# EasyEDA Pro project PCB_6N_2025-02-27.epro

# Board 6N_1
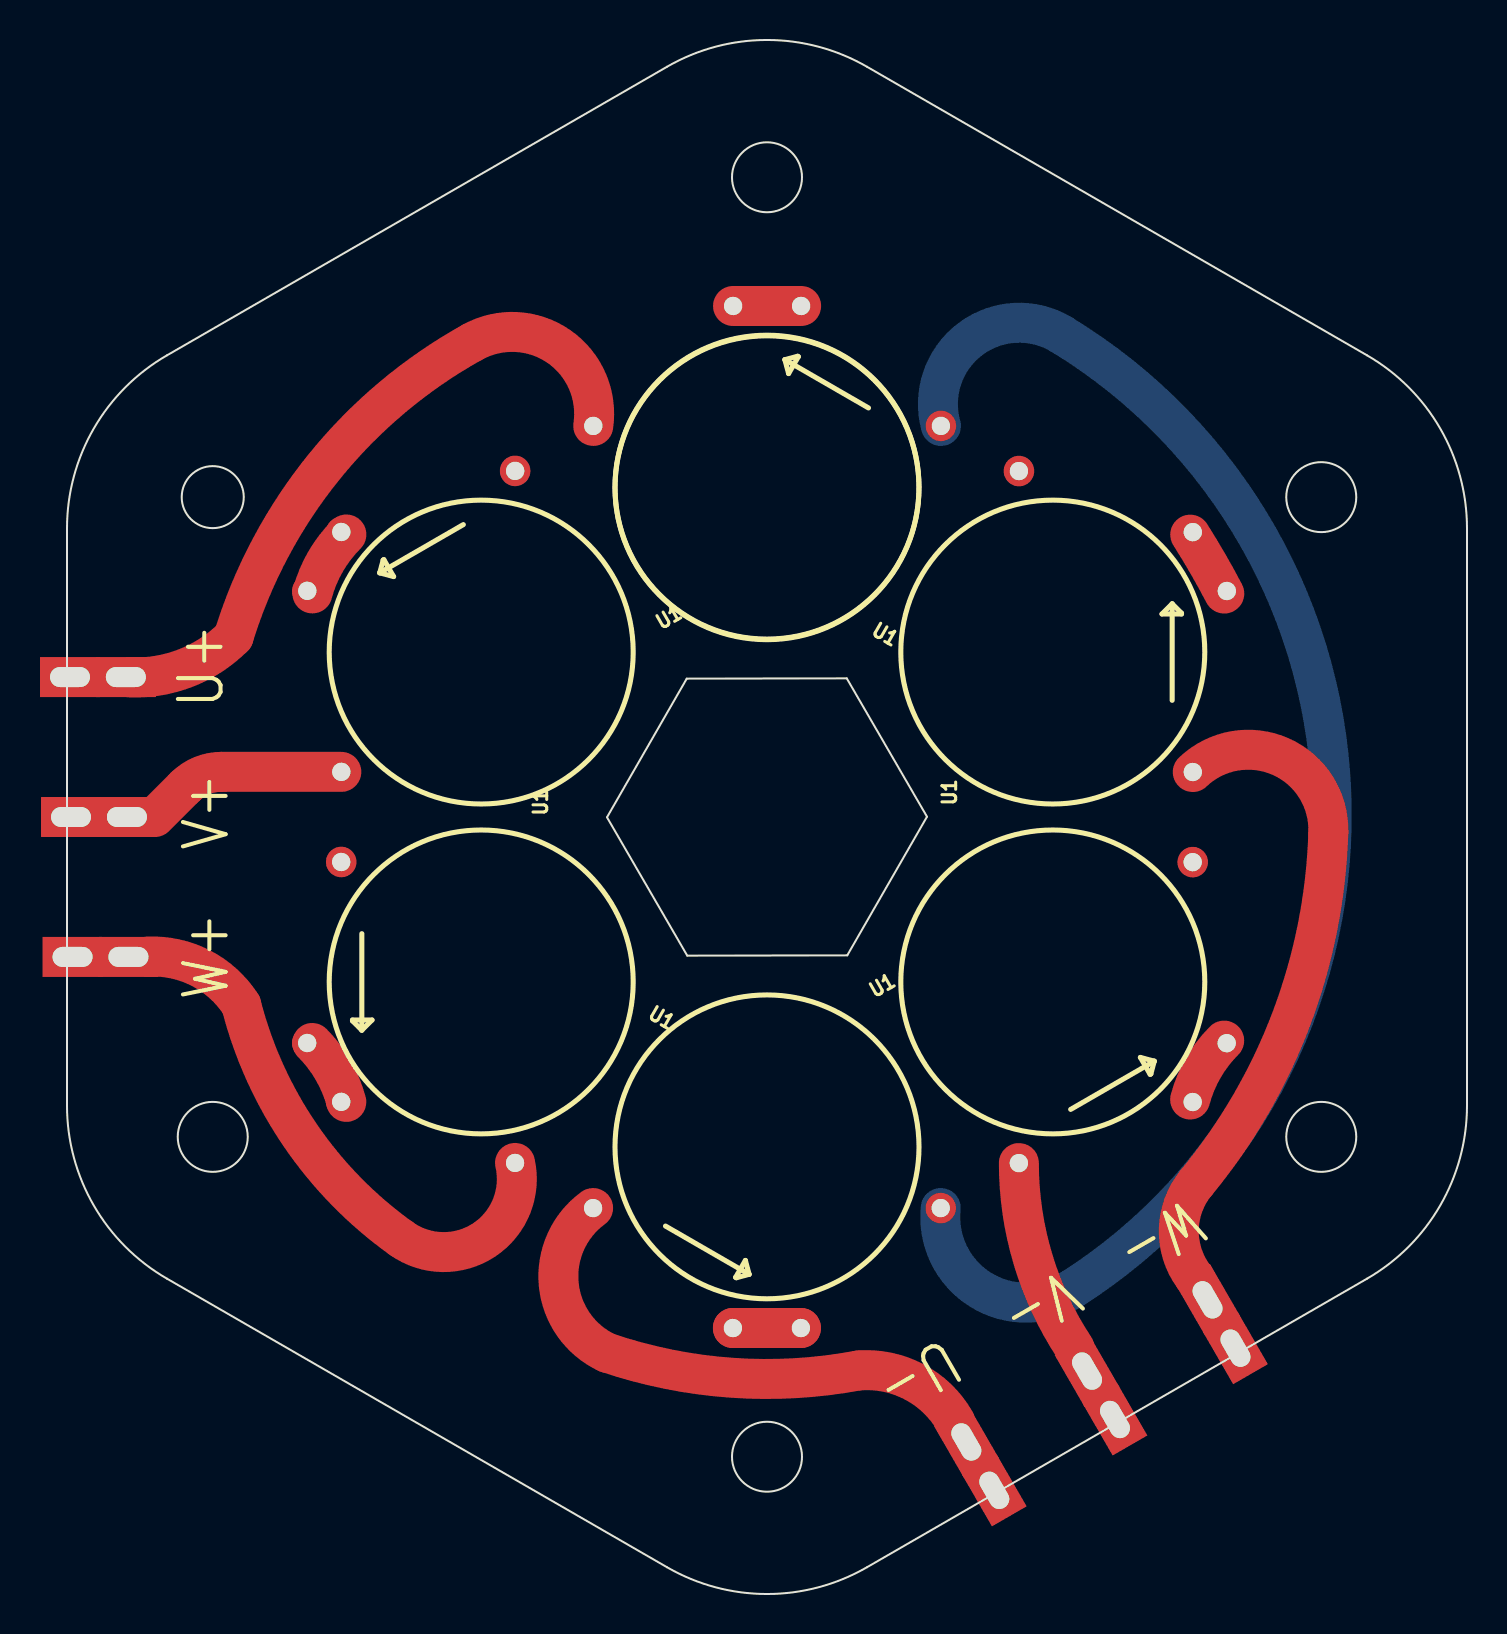
[diagram p0: board, top side]
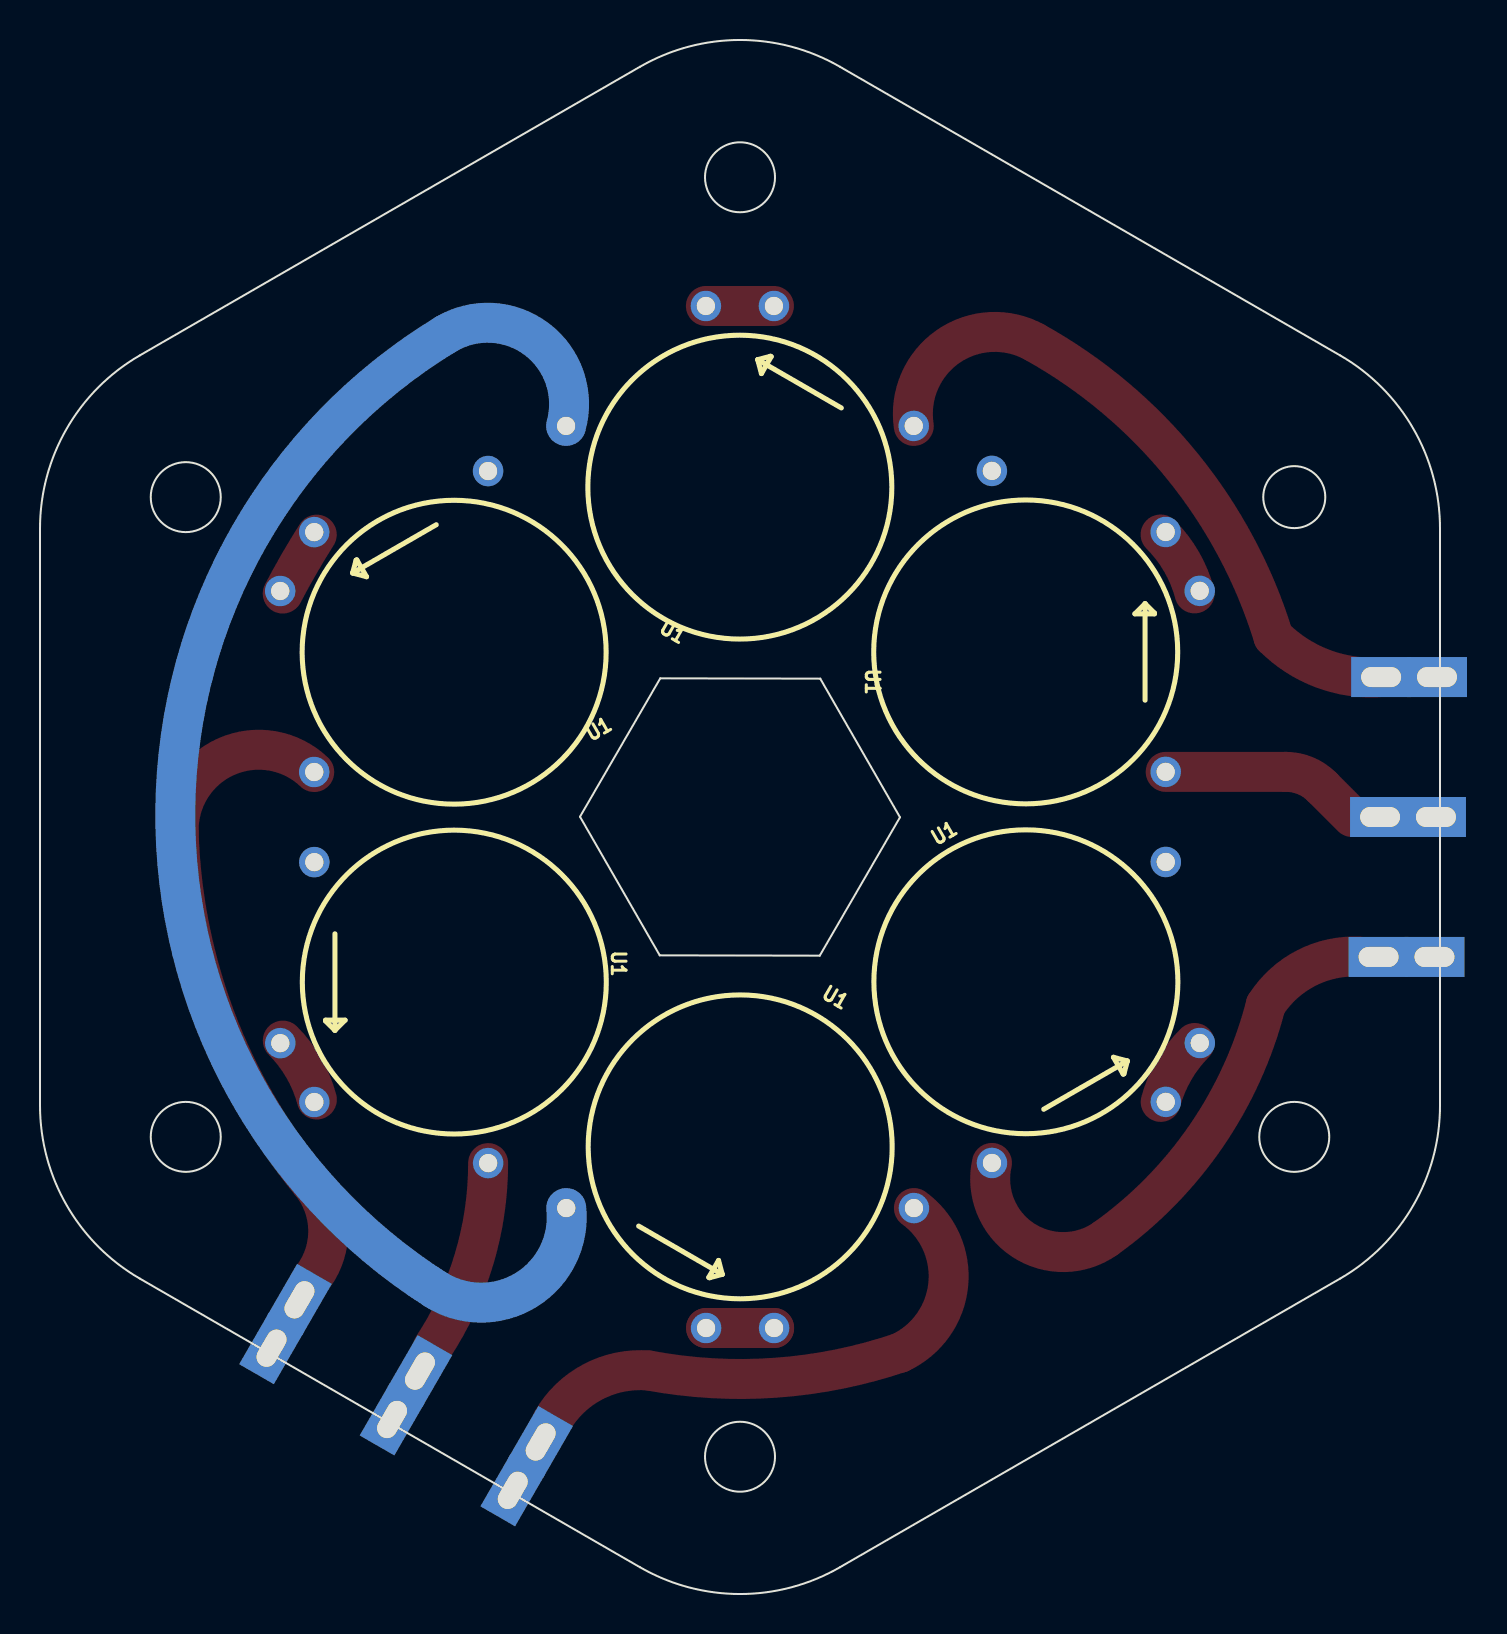
[diagram p1: board, bottom side, seen from below]

Outline 70 x 77.73 mm; copper layers: Top Layer, Inner1, Inner2, Bottom Layer. Coordinates in mm from the lower left corner of the outline.
Outline path: circle c7.29,54.87 r1.55 ; circle c7.29,22.87 r1.75 ; circle c35,70.87 r1.75 ; circle c35,6.87 r1.75 ; circle c62.71,54.87 r1.75 ; circle c62.71,22.87 r1.75 ; 0,53.3 0,24.43 arc(1.34,19.43) 5,15.77 30,1.34 arc(35,0) 40,1.34 65,15.77 arc(68.66,19.43) 70,24.43 70,53.3 arc(68.66,58.3) 65,61.96 40,76.39 arc(35,77.73) 30,76.39 5,61.96 arc(1.34,58.3) 0,53.3 ; 27,38.85 31.01,31.93 39.01,31.95 43,38.88 38.99,45.8 30.99,45.79 27,38.85
Stack: Top Layer 0.035mm 外层铜厚1oz / Dielectric1 0.2104mm 7628 RC49% 8.6mil / Inner1 0.0152mm 内层铜厚 / Dielectric2 1.065mm 1.1mm H/HOZ Copper / Inner2 0.0152mm 内层铜厚 / Dielectric3 0.2104mm 7628 RC49% 8.6mil / Bottom Layer 0.035mm 外层铜厚1oz

## Design rules (mm)
template: JLCPCB Capability(Two Layers Board)
spacing copperThickness1oz (default): track to track 0.102, other pairs 0.152 to 0.3
spacing copperThickness2oz: track to track 0.203, other pairs 0.152 to 0.3
track width copperThickness1oz (default): min 0.127, default 0.254, max 2.54
track width copperThickness2oz: min 0.203, default 0.254, max 2.54
differential pair differentialPair (default): width min 0.127, default 0.254, max 2.54; gap min 0.152, default 0.152
via viaSize (default): diameter min 0.5, default 0.61, max 10; hole min 0.3, default 0.305, max 6.3

## Placement (name value [footprint] x y rotation side)
NOREF  -  [Pad_e4749]  44.97 7.61 210 top
NOREF#2  -  [Pad_e4751]  52.4 8.73 210 top
NOREF#3  -  [Pad_e4746]  58.42 12.3 210 top
NOREF#4  -  [Pad_e4590]  51 11.15 210 top
NOREF#5  -  [Pad_e4747]  57.03 14.72 210 top
NOREF#6  -  [Pad_e4509]  3 38.87 90 top
NOREF#7  -  [Pad_e4748]  46.36 5.19 210 top
NOREF#8  -  [Pad_e4555]  0.2 38.87 90 top
NOREF#9  -  [Pad_e4687]  0.15 45.87 90 top
NOREF#10  -  [Pad_e4689]  0.28 31.87 90 top
NOREF#11  -  [Pad_e4690]  3.07 31.87 90 top
NOREF#12  -  [Pad_e4688]  2.94 45.87 90 top
U1  -  [CURRENT15]  35 55.37 150 top
U1#2  -  [CURRENT15]  20.71 47.12 210 top
U1#3  -  [CURRENT15]  20.71 30.62 270 top
U1#4  -  [CURRENT15]  35 22.37 330 top
U1#5  -  [CURRENT15]  49.29 30.62 30 top
U1#6  -  [CURRENT15]  49.29 47.12 90 top
U1#7  -  [CURRENT15]  20.72 47.12 90 bottom
U1#8  -  [CURRENT15]  20.71 30.62 150 bottom
U1#9  -  [CURRENT15]  34.99 22.37 210 bottom
U1#10  -  [CURRENT15]  49.28 30.61 270 bottom
U1#11  -  [CURRENT15]  49.29 47.11 330 bottom
U1#12  -  [CURRENT15]  35.01 55.37 30 bottom

## Footprints (pads in the part's own frame, mm; a bottom-side part is the same pattern mirrored in y, then rotated)
CURRENT15
  round 1.524 hole 0.914: 1(-6,-7) 2(6,-7)
Pad_e4509
  rect 2x3 hole 1x2: 10(0,0)
Pad_e4555
  rect 2x3 hole 1x2: 10(0,0)
Pad_e4590
  rect 2x3 hole 1x2: 14(0,0)
Pad_e4687
  rect 2x3 hole 1x2: 10(0,0)
Pad_e4688
  rect 2x3 hole 1x2: 10(0,0)
Pad_e4689
  rect 2x3 hole 1x2: 10(0,0)
Pad_e4690
  rect 2x3 hole 1x2: 10(0,0)
Pad_e4746
  rect 2x3 hole 1x2: 10(0,0)
Pad_e4747
  rect 2x3 hole 1x2: 11(0,0)
Pad_e4748
  rect 2x3 hole 1x2: 12(0,0)
Pad_e4749
  rect 2x3 hole 1x2: 13(0,0)
Pad_e4751
  rect 2x3 hole 1x2: 17(0,0)

## Nets
U+: NOREF#9.10 NOREF#12.10
U-: NOREF.13 NOREF#7.12
V+: NOREF#6.10 NOREF#8.10
V-: NOREF#2.17 NOREF#4.14
W+: NOREF#10.10 NOREF#11.10
W-: NOREF#3.10 NOREF#5.11

Pads without a net: U1 1 2; U1#2 1 2; U1#3 1 2; U1#4 1 2; U1#5 1 2; U1#6 1 2; U1#7 1 2; U1#8 1 2; U1#9 1 2; U1#10 1 2; U1#11 1 2; U1#12 1 2

## Routing (per net, layer and track width the routed paths; a pad name or vN(x,y) marks a point on that pad's centre or on a via; arc(x,y) is an arc through that point)
(no net): length 392
  Top Layer w2: U1#7.1 7.7,41.12 arc(6.73,40.93) 5.91,40.38 4.39,38.87 ; U1#9.2 33.3,13.31 36.69,13.31 U1#4.2 ; U1.2 36.71,64.43 ; 44.4,8.64 arc(42.35,10.61) 39.57,11.18 arc(33.23,10.82) 27,12.07 arc(24.59,15.49) U1#4.1 ; 4.01,31.88 arc(6.69,31.31) 8.71,29.47 arc(11.68,22.92) 16.71,17.79 arc(20.86,17.71) U1#8.1 ; U1#6.1 arc(60.69,41.89) 63.07,38.11 arc(61.23,28.79) 56.46,20.58 arc(55.59,18.25) 56.34,15.88 ; 13.97,53 arc(12.92,51.64) 12.27,50.05 ; 57.86,27.68 arc(56.81,26.32) 56.16,24.74 ; U1#5.1 arc(48.3,16.74) 50.37,12.32 ; U1#12.1 arc(24.59,62.4) 20.27,62.62 arc(12.87,56.41) 8.33,47.88 arc(5.94,46.32) 3.12,45.85 ; 56.16,52.99 arc(57.04,51.54) 57.86,50.04 ; 12.26,27.56 arc(13.31,26.2) 13.96,24.62
  Inner1 w2: U1#10.1 arc(60.86,35.81) 63.32,39.76 arc(49.68,62.95) 22.81,64.27 arc(20.2,60.34) U1#2.1
  Inner2 w2: U1#11.1 arc(49.84,60.24) 47.32,64.14 arc(20.45,63.01) 6.93,39.76 arc(9.29,35.96) U1#3.1
  Bottom Layer w2: U1#9.1 arc(45.69,15.21) 50.24,15.25 arc(63.24,39.26) 49.73,63 arc(45.16,62.77) U1.1

## Text on the board
Top Silkscreen Layer: U+ | V+ | W+ | U- | V- | W-
